# Altium schematic sheet LED RGBSchDoc.SchDoc
size A3; SheetNumber: 2; SheetTotal: 4
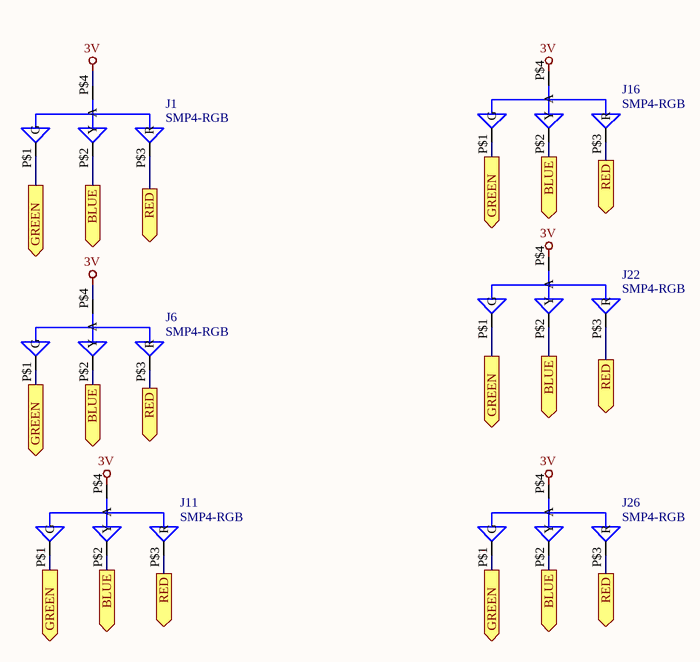
[diagram p0: LED RGBSchDoc.SchDoc]

## Parts
J1  SMP4-RGB  [4-PLCC]
J6  SMP4-RGB  [4-PLCC]
J11  SMP4-RGB  [4-PLCC]
J16  SMP4-RGB  [4-PLCC]
J22  SMP4-RGB  [4-PLCC]
J26  SMP4-RGB  [4-PLCC]

## Ports
BLUE (out, see LED RGBSchDoc[2B], LED RGBSchDoc[2C], LED RGBSchDoc[3A], LED RGBSchDoc[3B], LED RGBSchDoc[3C], Sheet1[2B]), BLUE (out, see LED RGBSchDoc[2B], LED RGBSchDoc[2C], LED RGBSchDoc[3A], LED RGBSchDoc[3B], Sheet1[2B]), BLUE (out, see LED RGBSchDoc[2B], LED RGBSchDoc[2C], LED RGBSchDoc[3A], LED RGBSchDoc[3C], Sheet1[2B]), BLUE (out, see LED RGBSchDoc[2B], LED RGBSchDoc[2C], LED RGBSchDoc[3B], LED RGBSchDoc[3C], Sheet1[2B]), BLUE (out, see LED RGBSchDoc[2B], LED RGBSchDoc[3A], LED RGBSchDoc[3B], LED RGBSchDoc[3C], Sheet1[2B]), GREEN (out, see LED RGBSchDoc[1B], LED RGBSchDoc[1C], LED RGBSchDoc[3B], LED RGBSchDoc[3C], Sheet1[2B]), GREEN (out, see LED RGBSchDoc[1B], LED RGBSchDoc[1C], LED RGBSchDoc[3B], Sheet1[2B]), GREEN (out, see LED RGBSchDoc[1B], LED RGBSchDoc[3B], LED RGBSchDoc[3C], Sheet1[2B]), RED (out, see LED RGBSchDoc[2B], LED RGBSchDoc[2C], LED RGBSchDoc[3A], LED RGBSchDoc[3B], LED RGBSchDoc[3C], Sheet1[2B]), RED (out, see LED RGBSchDoc[2B], LED RGBSchDoc[2C], LED RGBSchDoc[3A], LED RGBSchDoc[3B], Sheet1[2B]), RED (out, see LED RGBSchDoc[2B], LED RGBSchDoc[2C], LED RGBSchDoc[3A], LED RGBSchDoc[3C], Sheet1[2B]), RED (out, see LED RGBSchDoc[2B], LED RGBSchDoc[2C], LED RGBSchDoc[3B], LED RGBSchDoc[3C], Sheet1[2B]), RED (out, see LED RGBSchDoc[2B], LED RGBSchDoc[3A], LED RGBSchDoc[3B], LED RGBSchDoc[3C], Sheet1[2B])

## Nets
3V: J1.P$4(A) J6.P$4(A) J11.P$4(A) J16.P$4(A) J22.P$4(A) J26.P$4(A)
BLUE: J1.P$2(Y) J6.P$2(Y) J11.P$2(Y) J16.P$2(Y) J22.P$2(Y) J26.P$2(Y) ; port BLUE
GREEN: J1.P$1(G) J6.P$1(G) J11.P$1(G) J16.P$1(G) J22.P$1(G) J26.P$1(G) ; port GREEN
RED: J1.P$3(R) J6.P$3(R) J11.P$3(R) J16.P$3(R) J22.P$3(R) J26.P$3(R) ; port RED

## Library data of the parts
J1 J6 J11 J16 J22 J26 = SMP4-RGB: Red, Green, Blue (RGB) 640nm Red, 570nm Green, 466nm Blue LED Indication - Discrete 1.85V Red, 1.9V Green, 3.3V Blue 4-PLCC; MF: Bivar Inc.; SnapEDA_Link: https://www.snapeda.com/parts/SMP4-RGB/Bivar+Inc./view-part/?ref=snap; Package: PLCC-4 Bivar; Value: *; MP: SMP4-RGB; Check_prices: https://www.snapeda.com/parts/SMP4-RGB/Bivar+Inc./view-part/?ref=eda